# EAGLE schematic DRYER CONTROLLER (EAGLE 7.4.0)

## Sheet 1 of 6
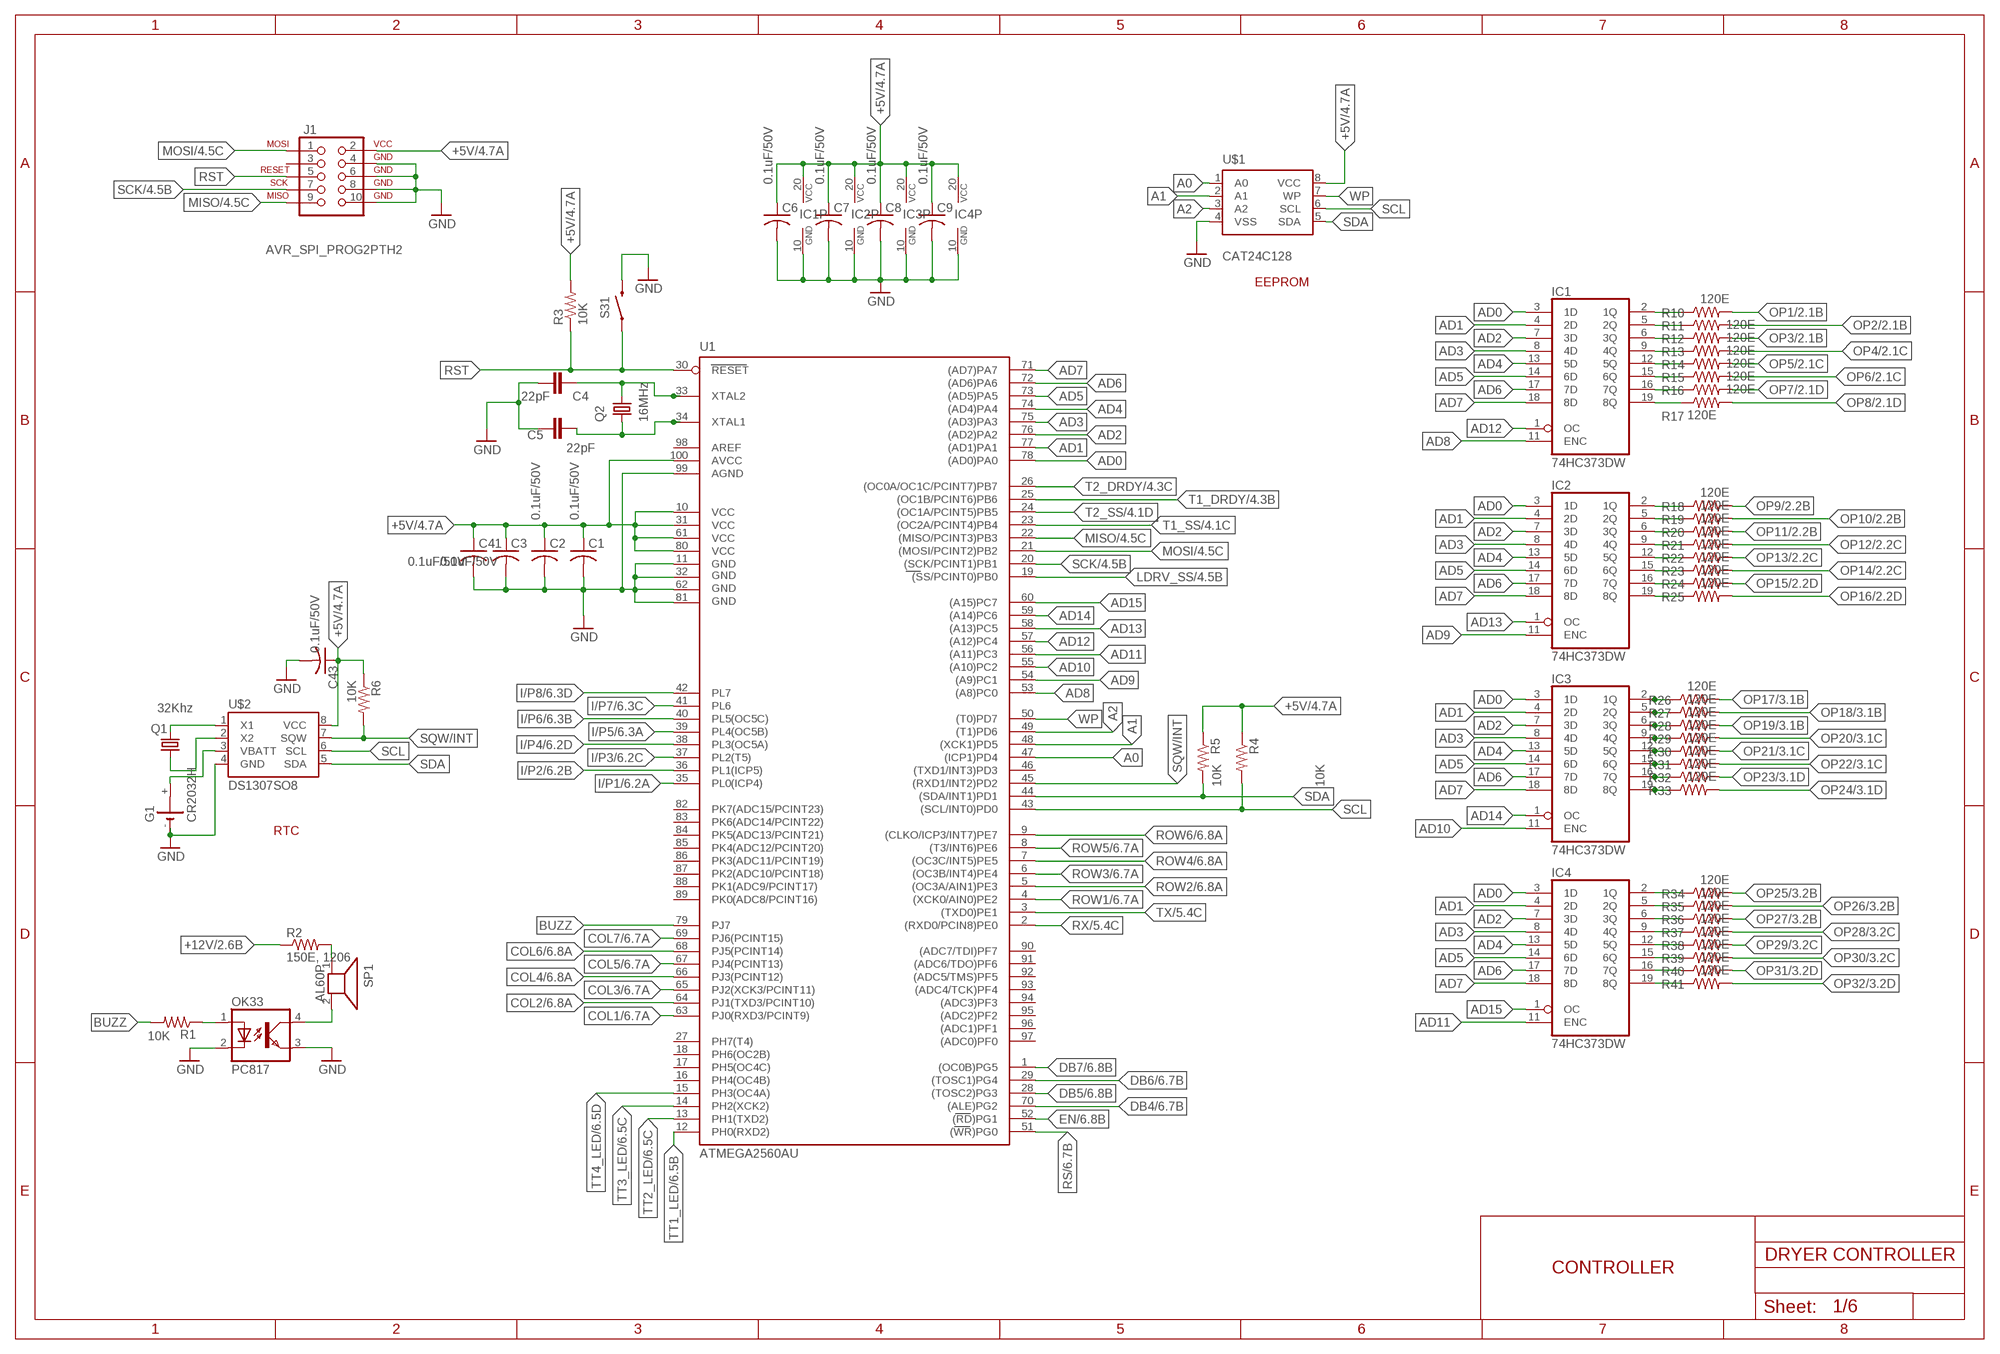
[diagram p0: schematic, sheet 1]

### Parts
C1  0.1uF/50V  C-USC0805K  [C0805K]
C2  0.1uF/50V  C-USC0805K  [C0805K]
C3  0.1uF/50V  C-USC0805K  [C0805K]
C4  22pF  CAP0805  [0805]
C5  22pF  CAP0805  [0805]
C6  0.1uF/50V  C-USC0805K  [C0805K]
C7  0.1uF/50V  C-USC0805K  [C0805K]
C8  0.1uF/50V  C-USC0805K  [C0805K]
C9  0.1uF/50V  C-USC0805K  [C0805K]
C41  0.1uF/50V  C-USC0805K  [C0805K]
C43  0.1uF/50V  C-USC0805K  [C0805K]
G1  CR2032H  [CR2032H]
IC1  74HC373DW  [SO20W]
IC2  74HC373DW  [SO20W]
IC3  74HC373DW  [SO20W]
IC4  74HC373DW  [SO20W]
J1  AVR_SPI_PROG2PTH2  [2X5-SHROUDED]
OK33  PC817  [DIL04]
Q1  32Khz  CRYSTALHC49S  [HC49/S]
Q2  16MHz  CRYSTALHC49S  [HC49/S]
R1  10K  R-US_R0805  [R0805]
R2  150E, 1206  R-US_R1206  [R1206]
R3  10K  R-US_R0805  [R0805]
R4  10K  R-US_R0805  [R0805]
R5  10K  R-US_R0805  [R0805]
R6  10K  R-US_R0805  [R0805]
R10  120E  R-US_R0805  [R0805]
R11  120E  R-US_R0805  [R0805]
R12  120E  R-US_R0805  [R0805]
R13  120E  R-US_R0805  [R0805]
R14  120E  R-US_R0805  [R0805]
R15  120E  R-US_R0805  [R0805]
R16  120E  R-US_R0805  [R0805]
R17  120E  R-US_R0805  [R0805]
R18  120E  R-US_R0805  [R0805]
R19  120E  R-US_R0805  [R0805]
R20  120E  R-US_R0805  [R0805]
R21  120E  R-US_R0805  [R0805]
R22  120E  R-US_R0805  [R0805]
R23  120E  R-US_R0805  [R0805]
R24  120E  R-US_R0805  [R0805]
R25  120E  R-US_R0805  [R0805]
R26  120E  R-US_R0805  [R0805]
R27  120E  R-US_R0805  [R0805]
R28  120E  R-US_R0805  [R0805]
R29  120E  R-US_R0805  [R0805]
R30  120E  R-US_R0805  [R0805]
R31  120E  R-US_R0805  [R0805]
R32  120E  R-US_R0805  [R0805]
R33  120E  R-US_R0805  [R0805]
R34  120E  R-US_R0805  [R0805]
R35  120E  R-US_R0805  [R0805]
R36  120E  R-US_R0805  [R0805]
R37  120E  R-US_R0805  [R0805]
R38  120E  R-US_R0805  [R0805]
R39  120E  R-US_R0805  [R0805]
R40  120E  R-US_R0805  [R0805]
R41  120E  R-US_R0805  [R0805]
S31  SWITCH-MOMENTARY-2SMD-4  [TACTILE_SWITCH_TALL]
SP1  AL60P  [AL60P]
U1  ATMEGA2560AU  [TQFP100]
U$1  CAT24C128  [SOIC8]
U$2  DS1307SO8  [SO08]

### Nets
+5V: C1.1 C2.1 C3.1 C6.1 C7.1 C8.1 C9.1 C41.1 C43.1 IC1.20(VCC) IC2.20(VCC) IC3.20(VCC) IC4.20(VCC) J1.2(VCC) R3.2 R4.1 R5.1 R6.1 U1.10(VCC) U1.31(VCC1) U1.61(VCC2) U1.80(VCC3) U1.100(AVCC) U$1.8(VCC) U$2.8(VCC) ; also sheet 4,5,6
+12V: R2.1 ; also sheet 2,3,4,6
A0: U1.47((ICP1)PD4) U$1.1(A0)
A1: U1.48((XCK1)PD5) U$1.2(A1)
A2: U1.49((T1)PD6) U$1.3(A2)
AD0: IC1.3(1D) IC2.3(1D) IC3.3(1D) IC4.3(1D) U1.78((AD0)PA0)
AD1: IC1.4(2D) IC2.4(2D) IC3.4(2D) IC4.4(2D) U1.77((AD1)PA1)
AD2: IC1.7(3D) IC2.7(3D) IC3.7(3D) IC4.7(3D) U1.76((AD2)PA2)
AD3: IC1.8(4D) IC2.8(4D) IC3.8(4D) IC4.8(4D) U1.75((AD3)PA3)
AD4: IC1.13(5D) IC2.13(5D) IC3.13(5D) IC4.13(5D) U1.74((AD4)PA4)
AD5: IC1.14(6D) IC2.14(6D) IC3.14(6D) IC4.14(6D) U1.73((AD5)PA5)
AD6: IC1.17(7D) IC2.17(7D) IC3.17(7D) IC4.17(7D) U1.72((AD6)PA6)
AD7: IC1.18(8D) IC2.18(8D) IC3.18(8D) IC4.18(8D) U1.71((AD7)PA7)
AD8: IC1.11(ENC) U1.53((A8)PC0)
AD9: IC2.11(ENC) U1.54((A9)PC1)
AD10: IC3.11(ENC) U1.55((A10)PC2)
AD11: IC4.11(ENC) U1.56((A11)PC3)
AD12: IC1.1(OC) U1.57((A12)PC4)
AD13: IC2.1(OC) U1.58((A13)PC5)
AD14: IC3.1(OC) U1.59((A14)PC6)
AD15: IC4.1(OC) U1.60((A15)PC7)
BUZZ: R1.2 U1.79(PJ7)
COL1: U1.63(PJ0(RXD3/PCINT9)) ; also sheet 6
COL2: U1.64(PJ1(TXD3/PCINT10)) ; also sheet 6
COL3: U1.65(PJ2(XCK3/PCINT11)) ; also sheet 6
COL4: U1.66(PJ3(PCINT12)) ; also sheet 6
COL5: U1.67(PJ4(PCINT13)) ; also sheet 6
COL6: U1.68(PJ5(PCINT14)) ; also sheet 6
COL7: U1.69(PJ6(PCINT15)) ; also sheet 6
DB4: U1.70((ALE)PG2) ; also sheet 6
DB5: U1.28((TOSC2)PG3) ; also sheet 6
DB6: U1.29((TOSC1)PG4) ; also sheet 6
DB7: U1.1((OC0B)PG5) ; also sheet 6
EN: U1.52((RD)PG1) ; also sheet 6
GND [gnd]: C1.2 C2.2 C3.2 C4.1 C5.1 C6.2 C7.2 C8.2 C9.2 C41.2 C43.2 G1.- IC1.10(GND) IC2.10(GND) IC3.10(GND) IC4.10(GND) J1.4(GND) J1.6(GND) J1.8(GND) J1.10(GND) OK33.2(C) OK33.3(EMIT) S31.B2 U1.11(GND) U1.32(GND1) U1.62(GND2) U1.81(GND3) U1.99(AGND) U$1.4(VSS) U$2.4(GND) ; also sheet 2,3,4,5,6
I/P1: U1.35(PL0(ICP4)) ; also sheet 6
I/P2: U1.36(PL1(ICP5)) ; also sheet 6
I/P3: U1.37(PL2(T5)) ; also sheet 6
I/P4: U1.38(PL3(OC5A)) ; also sheet 6
I/P5: U1.39(PL4(OC5B)) ; also sheet 6
I/P6: U1.40(PL5(OC5C)) ; also sheet 6
I/P7: U1.41(PL6) ; also sheet 6
I/P8: U1.42(PL7) ; also sheet 6
LDRV_SS: U1.19((SS/PCINT0)PB0) ; also sheet 4
MISO: J1.9(MISO) U1.22((MISO/PCINT3)PB3) ; also sheet 4
MOSI: J1.1(MOSI) U1.21((MOSI/PCINT2)PB2) ; also sheet 4
N$3: G1.+ U$2.3(VBATT)
N$4: Q1.2 U$2.2(X2)
N$5: Q1.1 U$2.1(X1)
N$6: C4.2 Q2.2 U1.33(XTAL2)
N$7: C5.2 Q2.1 U1.34(XTAL1)
N$8: IC1.2(1Q) R10.1
N$9: R2.2 SP1.1
N$10: OK33.1(A) R1.1
N$11: IC1.5(2Q) R11.1
N$12: IC1.6(3Q) R12.1
N$13: IC1.9(4Q) R13.1
N$14: IC1.12(5Q) R14.1
N$15: IC1.15(6Q) R15.1
N$16: IC1.16(7Q) R16.1
N$17: IC1.19(8Q) R17.1
N$18: IC2.2(1Q) R18.1
N$19: IC2.5(2Q) R19.1
N$20: IC2.6(3Q) R20.1
N$21: IC2.9(4Q) R21.1
N$22: IC2.12(5Q) R22.1
N$23: IC2.15(6Q) R23.1
N$24: IC2.16(7Q) R24.1
N$25: IC2.19(8Q) R25.1
N$26: IC3.2(1Q) R26.1
N$27: IC3.5(2Q) R27.1
N$28: IC3.6(3Q) R28.1
N$29: IC3.9(4Q) R29.1
N$30: IC3.12(5Q) R30.1
N$31: IC3.15(6Q) R31.1
N$32: IC3.16(7Q) R32.1
N$33: IC4.19(8Q) R41.1
N$34: IC3.19(8Q) R33.1
N$35: IC4.16(7Q) R40.1
N$36: IC4.15(6Q) R39.1
N$37: IC4.12(5Q) R38.1
N$38: IC4.9(4Q) R37.1
N$39: IC4.6(3Q) R36.1
N$40: IC4.5(2Q) R35.1
N$41: IC4.2(1Q) R34.1
N$74: OK33.4(COL) SP1.2
OP1: R10.2 ; also sheet 2
OP2: R11.2 ; also sheet 2
OP3: R12.2 ; also sheet 2
OP4: R13.2 ; also sheet 2
OP5: R14.2 ; also sheet 2
OP6: R15.2 ; also sheet 2
OP7: R16.2 ; also sheet 2
OP8: R17.2 ; also sheet 2
OP9: R18.2 ; also sheet 2
OP10: R19.2 ; also sheet 2
OP11: R20.2 ; also sheet 2
OP12: R21.2 ; also sheet 2
OP13: R22.2 ; also sheet 2
OP14: R23.2 ; also sheet 2
OP15: R24.2 ; also sheet 2
OP16: R25.2 ; also sheet 2
OP17: R26.2 ; also sheet 3
OP18: R27.2 ; also sheet 3
OP19: R28.2 ; also sheet 3
OP20: R29.2 ; also sheet 3
OP21: R30.2 ; also sheet 3
OP22: R31.2 ; also sheet 3
OP23: R32.2 ; also sheet 3
OP24: R33.2 ; also sheet 3
OP25: R34.2 ; also sheet 3
OP26: R35.2 ; also sheet 3
OP27: R36.2 ; also sheet 3
OP28: R37.2 ; also sheet 3
OP29: R38.2 ; also sheet 3
OP30: R39.2 ; also sheet 3
OP31: R40.2 ; also sheet 3
OP32: R41.2 ; also sheet 3
ROW1: U1.4((XCK0/AIN0)PE2) ; also sheet 6
ROW2: U1.5((OC3A/AIN1)PE3) ; also sheet 6
ROW3: U1.6((OC3B/INT4)PE4) ; also sheet 6
ROW4: U1.7((OC3C/INT5)PE5) ; also sheet 6
ROW5: U1.8((T3/INT6)PE6) ; also sheet 6
ROW6: U1.9((CLKO/ICP3/INT7)PE7) ; also sheet 6
RS: U1.51((WR)PG0) ; also sheet 6
RST: J1.5(RESET) R3.1 S31.A2 U1.30(RESET)
RX: U1.2((RXD0/PCIN8)PE0) ; also sheet 5
SCK: J1.7(SCK) U1.20((SCK/PCINT1)PB1) ; also sheet 4
SCL: R4.2 U1.43((SCL/INT0)PD0) U$1.6(SCL) U$2.6(SCL)
SDA: R5.2 U1.44((SDA/INT1)PD1) U$1.5(SDA) U$2.5(SDA)
SQW/INT: R6.2 U1.45((RXD1/INT2)PD2) U$2.7(SQW)
T1_DRDY: U1.25((OC1B/PCINT6)PB6) ; also sheet 4
T1_SS: U1.23((OC2A/PCINT4)PB4) ; also sheet 4
T2_DRDY: U1.26((OC0A/OC1C/PCINT7)PB7) ; also sheet 4
T2_SS: U1.24((OC1A/PCINT5)PB5) ; also sheet 4
TT1_LED: U1.12(PH0(RXD2)) ; also sheet 6
TT2_LED: U1.13(PH1(TXD2)) ; also sheet 6
TT3_LED: U1.14(PH2(XCK2)) ; also sheet 6
TT4_LED: U1.15(PH3(OC4A)) ; also sheet 6
TX: U1.3((TXD0)PE1) ; also sheet 5
WP: U1.50((T0)PD7) U$1.7(WP)
Unconnected: G1.+@1(+) J1.3(NC) U1.16(PH4(OC4B)) U1.17(PH5(OC4C)) U1.18(PH6(OC2B)) U1.27(PH7(T4)) U1.46((TXD1/INT3)PD3) U1.82(PK7(ADC15/PCINT23)) U1.83(PK6(ADC14/PCINT22)) U1.84(PK5(ADC13/PCINT21)) U1.85(PK4(ADC12/PCINT20)) U1.86(PK3(ADC11/PCINT19)) U1.87(PK2(ADC10/PCINT18)) U1.88(PK1(ADC9/PCINT17)) U1.89(PK0(ADC8/PCINT16)) U1.90((ADC7/TDI)PF7) U1.91((ADC6/TDO)PF6) U1.92((ADC5/TMS)PF5) U1.93((ADC4/TCK)PF4) U1.94((ADC3)PF3) U1.95((ADC2)PF2) U1.96((ADC1)PF1) U1.97((ADC0)PF0) U1.98(AREF)

### Notes on the sheet
- EEPROM
- RTC
- CONTROLLER

## Sheet 2 of 6
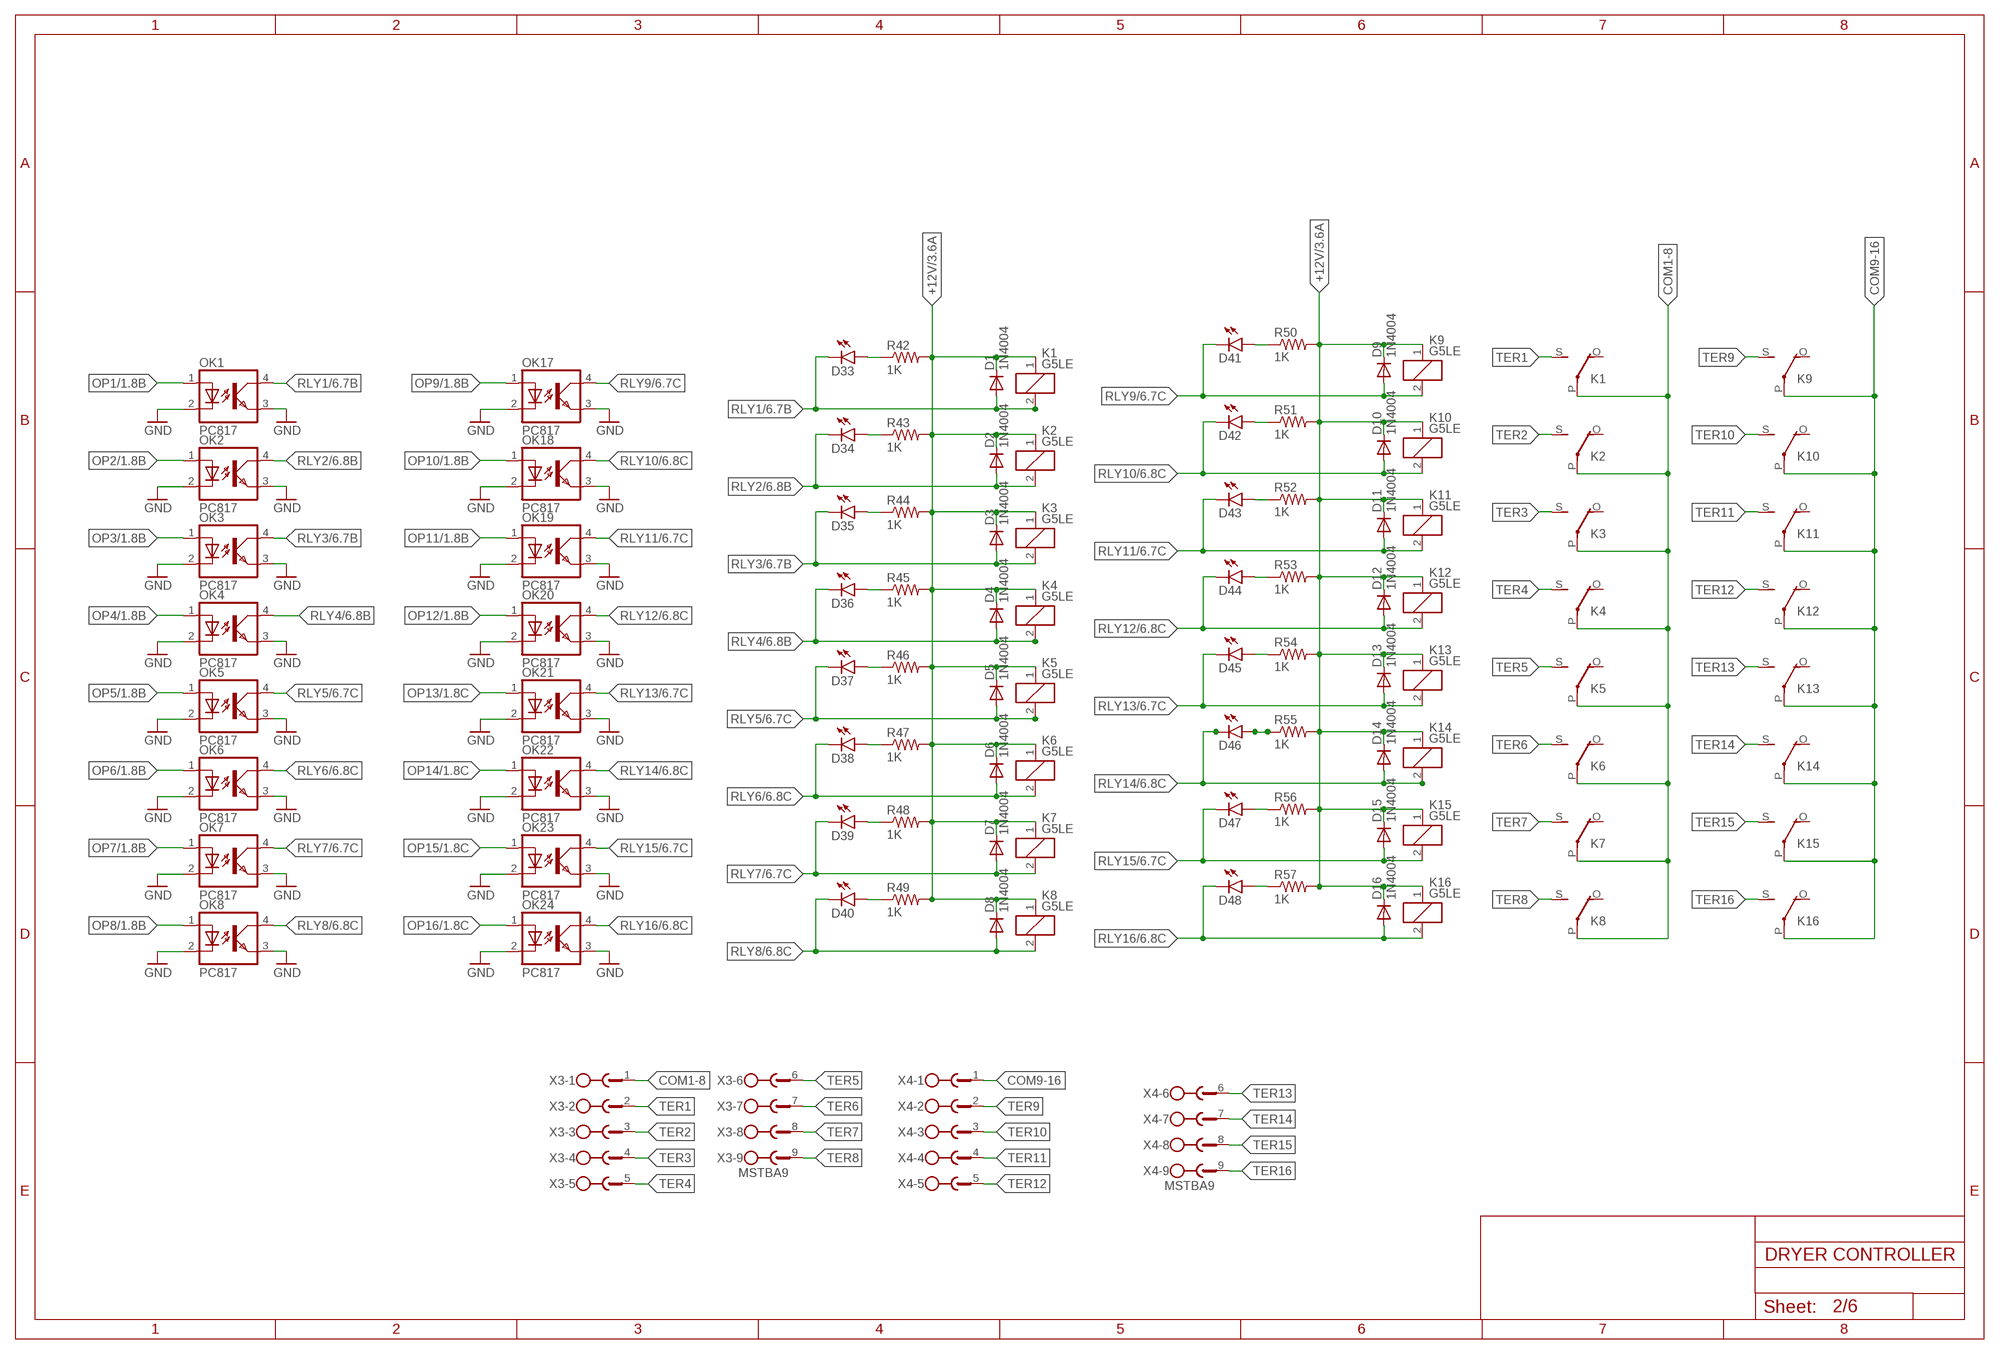
[diagram p1: schematic, sheet 2]

### Parts
D1  1N4004  [DO41-10]
D2  1N4004  [DO41-10]
D3  1N4004  [DO41-10]
D4  1N4004  [DO41-10]
D5  1N4004  [DO41-10]
D6  1N4004  [DO41-10]
D7  1N4004  [DO41-10]
D8  1N4004  [DO41-10]
D9  1N4004  [DO41-10]
D10  1N4004  [DO41-10]
D11  1N4004  [DO41-10]
D12  1N4004  [DO41-10]
D13  1N4004  [DO41-10]
D14  1N4004  [DO41-10]
D15  1N4004  [DO41-10]
D16  1N4004  [DO41-10]
D33  LED1206  [LED-1206]
D34  LED1206  [LED-1206]
D35  LED1206  [LED-1206]
D36  LED1206  [LED-1206]
D37  LED1206  [LED-1206]
D38  LED1206  [LED-1206]
D39  LED1206  [LED-1206]
D40  LED1206  [LED-1206]
D41  LED1206  [LED-1206]
D42  LED1206  [LED-1206]
D43  LED1206  [LED-1206]
D44  LED1206  [LED-1206]
D45  LED1206  [LED-1206]
D46  LED1206  [LED-1206]
D47  LED1206  [LED-1206]
D48  LED1206  [LED-1206]
K1  G5LE  [G5LE]
K2  G5LE  [G5LE]
K3  G5LE  [G5LE]
K4  G5LE  [G5LE]
K5  G5LE  [G5LE]
K6  G5LE  [G5LE]
K7  G5LE  [G5LE]
K8  G5LE  [G5LE]
K9  G5LE  [G5LE]
K10  G5LE  [G5LE]
K11  G5LE  [G5LE]
K12  G5LE  [G5LE]
K13  G5LE  [G5LE]
K14  G5LE  [G5LE]
K15  G5LE  [G5LE]
K16  G5LE  [G5LE]
OK1  PC817  [DIL04]
OK2  PC817  [DIL04]
OK3  PC817  [DIL04]
OK4  PC817  [DIL04]
OK5  PC817  [DIL04]
OK6  PC817  [DIL04]
OK7  PC817  [DIL04]
OK8  PC817  [DIL04]
OK17  PC817  [DIL04]
OK18  PC817  [DIL04]
OK19  PC817  [DIL04]
OK20  PC817  [DIL04]
OK21  PC817  [DIL04]
OK22  PC817  [DIL04]
OK23  PC817  [DIL04]
OK24  PC817  [DIL04]
R42  1K  R-US_R0805  [R0805]
R43  1K  R-US_R0805  [R0805]
R44  1K  R-US_R0805  [R0805]
R45  1K  R-US_R0805  [R0805]
R46  1K  R-US_R0805  [R0805]
R47  1K  R-US_R0805  [R0805]
R48  1K  R-US_R0805  [R0805]
R49  1K  R-US_R0805  [R0805]
R50  1K  R-US_R0805  [R0805]
R51  1K  R-US_R0805  [R0805]
R52  1K  R-US_R0805  [R0805]
R53  1K  R-US_R0805  [R0805]
R54  1K  R-US_R0805  [R0805]
R55  1K  R-US_R0805  [R0805]
R56  1K  R-US_R0805  [R0805]
R57  1K  R-US_R0805  [R0805]
X3  MSTBA9  [MSTBA9]
X4  MSTBA9  [MSTBA9]

### Nets
+12V: D1.C D2.C D3.C D4.C D5.C D6.C D7.C D8.C D9.C D10.C D11.C D12.C D13.C D14.C D15.C D16.C K1.1 K2.1 K3.1 K4.1 K5.1 K6.1 K7.1 K8.1 K9.1 K10.1 K11.1 K12.1 K13.1 K14.1 K15.1 K16.1 R42.2 R43.2 R44.2 R45.2 R46.2 R47.2 R48.2 R49.2 R50.2 R51.2 R52.2 R53.2 R54.2 R55.2 R56.2 R57.2 ; also sheet 1,3,4,6
COM1-8: K1.P(2:P) K2.P(2:P) K3.P(2:P) K4.P(2:P) K5.P(2:P) K6.P(2:P) K7.P(2:P) K8.P(2:P) X3.1
COM9-16: K9.P(2:P) K10.P(2:P) K11.P(2:P) K12.P(2:P) K13.P(2:P) K14.P(2:P) K15.P(2:P) K16.P(2:P) X4.1
GND [gnd]: OK1.2(C) OK1.3(EMIT) OK2.2(C) OK2.3(EMIT) OK3.2(C) OK3.3(EMIT) OK4.2(C) OK4.3(EMIT) OK5.2(C) OK5.3(EMIT) OK6.2(C) OK6.3(EMIT) OK7.2(C) OK7.3(EMIT) OK8.2(C) OK8.3(EMIT) OK17.2(C) OK17.3(EMIT) OK18.2(C) OK18.3(EMIT) OK19.2(C) OK19.3(EMIT) OK20.2(C) OK20.3(EMIT) OK21.2(C) OK21.3(EMIT) OK22.2(C) OK22.3(EMIT) OK23.2(C) OK23.3(EMIT) OK24.2(C) OK24.3(EMIT) ; also sheet 1,3,4,5,6
N$42: D33.A R42.1
N$43: D34.A R43.1
N$44: D35.A R44.1
N$45: D36.A R45.1
N$46: D37.A R46.1
N$47: D38.A R47.1
N$48: D39.A R48.1
N$49: D40.A R49.1
N$50: D41.A R50.1
N$51: D42.A R51.1
N$52: D43.A R52.1
N$53: D44.A R53.1
N$55: D45.A R54.1
N$58: D47.A R56.1
N$59: D48.A R57.1
N$73: D46.A R55.1
OP1: OK1.1(A) ; also sheet 1
OP2: OK2.1(A) ; also sheet 1
OP3: OK3.1(A) ; also sheet 1
OP4: OK4.1(A) ; also sheet 1
OP5: OK5.1(A) ; also sheet 1
OP6: OK6.1(A) ; also sheet 1
OP7: OK7.1(A) ; also sheet 1
OP8: OK8.1(A) ; also sheet 1
OP9: OK17.1(A) ; also sheet 1
OP10: OK18.1(A) ; also sheet 1
OP11: OK19.1(A) ; also sheet 1
OP12: OK20.1(A) ; also sheet 1
OP13: OK21.1(A) ; also sheet 1
OP14: OK22.1(A) ; also sheet 1
OP15: OK23.1(A) ; also sheet 1
OP16: OK24.1(A) ; also sheet 1
RLY1: D1.A D33.C K1.2 OK1.4(COL) ; also sheet 6
RLY2: D2.A D34.C K2.2 OK2.4(COL) ; also sheet 6
RLY3: D3.A D35.C K3.2 OK3.4(COL) ; also sheet 6
RLY4: D4.A D36.C K4.2 OK4.4(COL) ; also sheet 6
RLY5: D5.A D37.C K5.2 OK5.4(COL) ; also sheet 6
RLY6: D6.A D38.C K6.2 OK6.4(COL) ; also sheet 6
RLY7: D7.A D39.C K7.2 OK7.4(COL) ; also sheet 6
RLY8: D8.A D40.C K8.2 OK8.4(COL) ; also sheet 6
RLY9: D9.A D41.C K9.2 OK17.4(COL) ; also sheet 6
RLY10: D10.A D42.C K10.2 OK18.4(COL) ; also sheet 6
RLY11: D11.A D43.C K11.2 OK19.4(COL) ; also sheet 6
RLY12: D12.A D44.C K12.2 OK20.4(COL) ; also sheet 6
RLY13: D13.A D45.C K13.2 OK21.4(COL) ; also sheet 6
RLY14: D14.A D46.C K14.2 OK22.4(COL) ; also sheet 6
RLY15: D15.A D47.C K15.2 OK23.4(COL) ; also sheet 6
RLY16: D16.A D48.C K16.2 OK24.4(COL) ; also sheet 6
TER1: K1.S(2:S) X3.2
TER2: K2.S(2:S) X3.3
TER3: K3.S(2:S) X3.4
TER4: K4.S(2:S) X3.5
TER5: K5.S(2:S) X3.6
TER6: K6.S(2:S) X3.7
TER7: K7.S(2:S) X3.8
TER8: K8.S(2:S) X3.9
TER9: K9.S(2:S) X4.2
TER10: K10.S(2:S) X4.3
TER11: K11.S(2:S) X4.4
TER12: K12.S(2:S) X4.5
TER13: K13.S(2:S) X4.6
TER14: K14.S(2:S) X4.7
TER15: K15.S(2:S) X4.8
TER16: K16.S(2:S) X4.9
Unconnected: K1.O(2:O) K2.O(2:O) K3.O(2:O) K4.O(2:O) K5.O(2:O) K6.O(2:O) K7.O(2:O) K8.O(2:O) K9.O(2:O) K10.O(2:O) K11.O(2:O) K12.O(2:O) K13.O(2:O) K14.O(2:O) K15.O(2:O) K16.O(2:O)

## Sheet 3 of 6
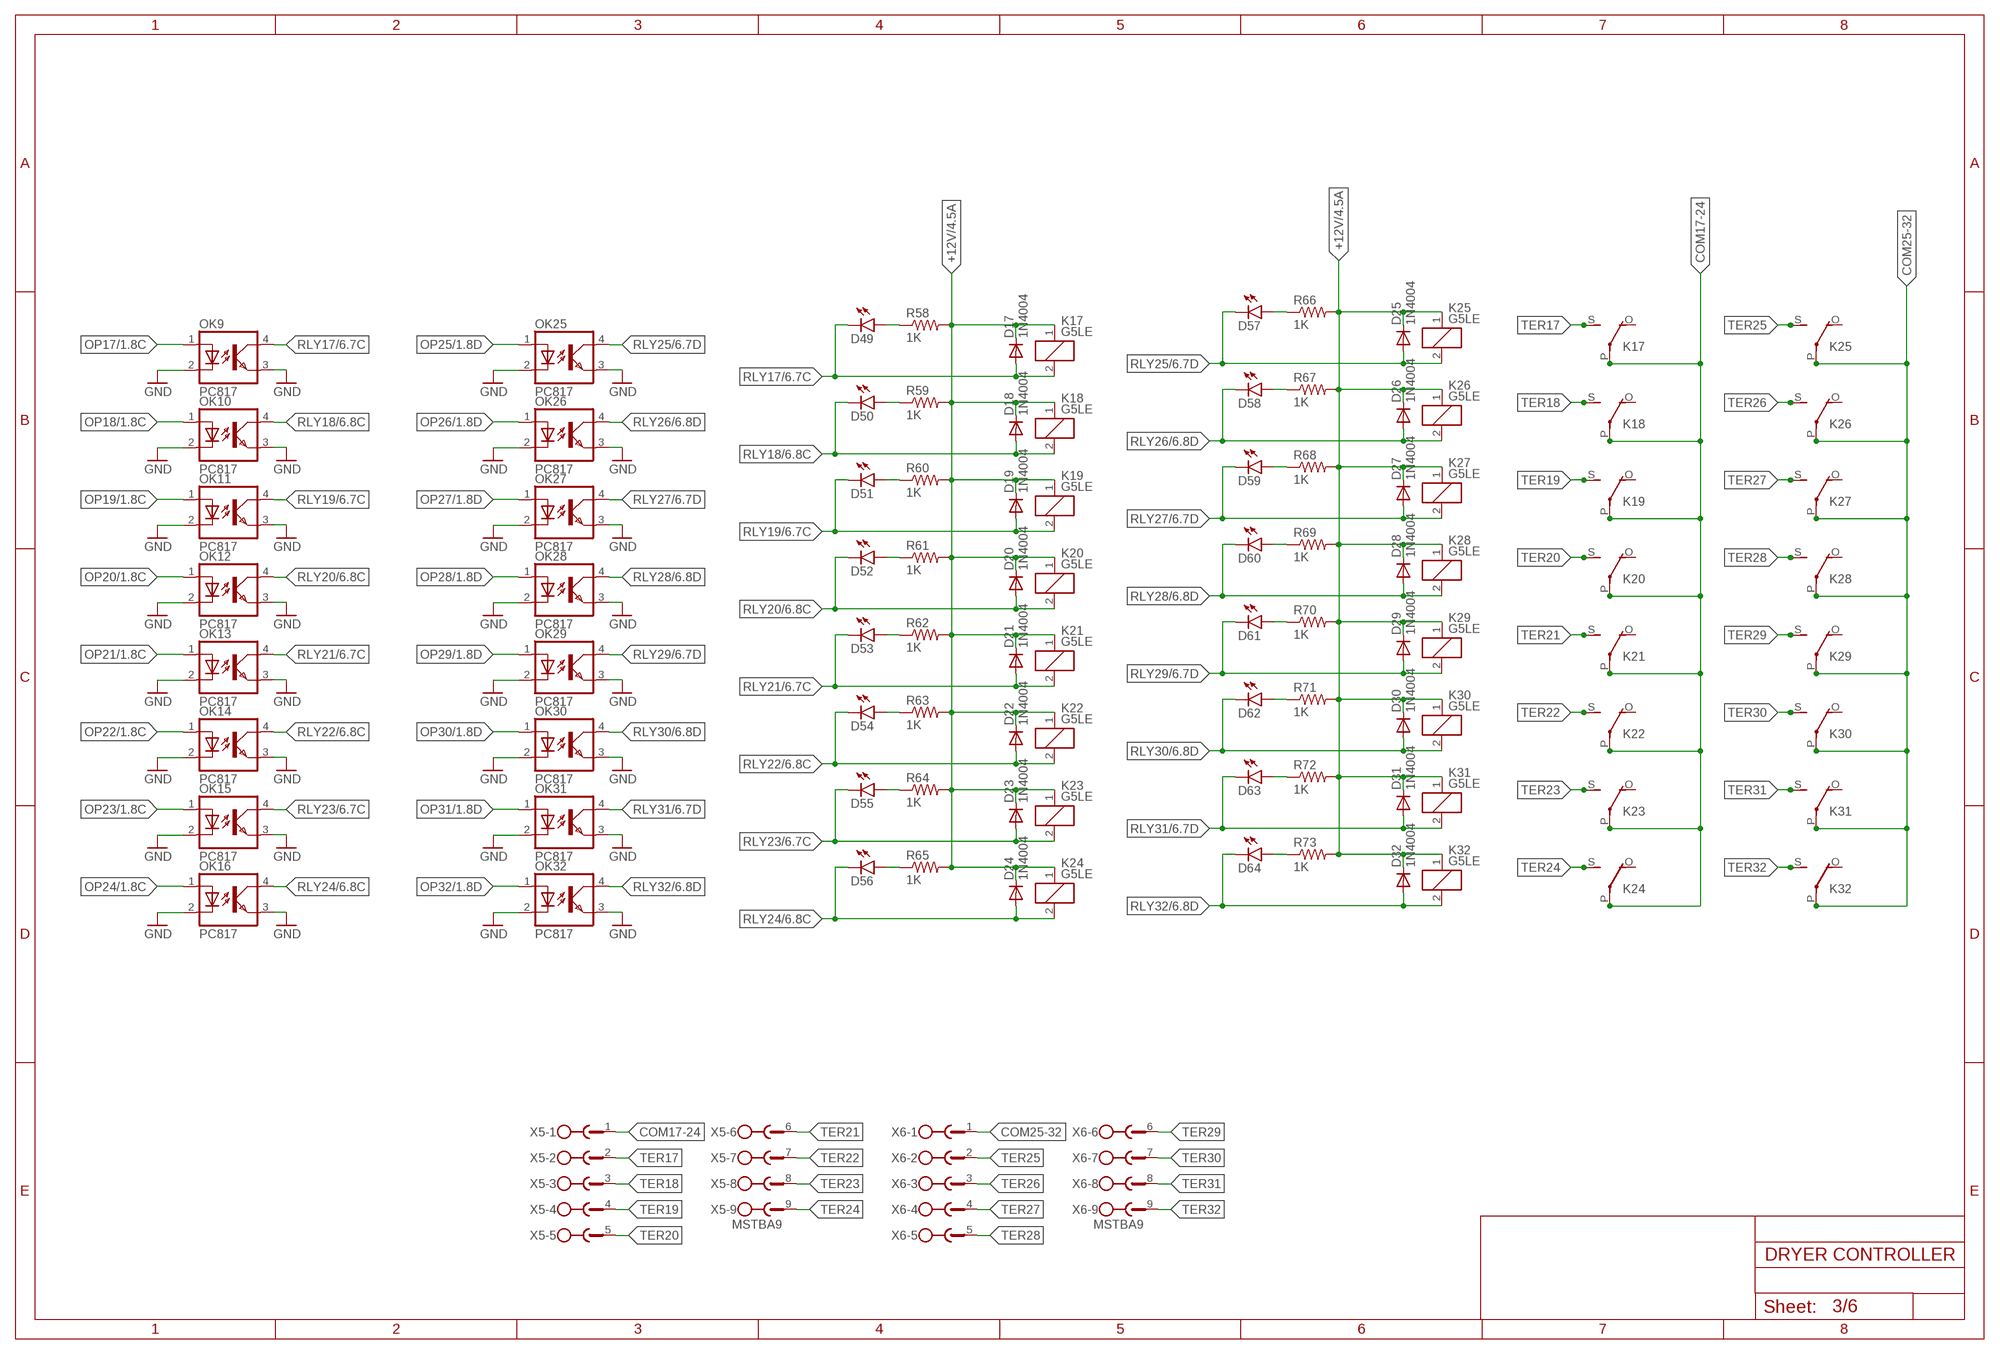
[diagram p2: schematic, sheet 3]

### Parts
D17  1N4004  [DO41-10]
D18  1N4004  [DO41-10]
D19  1N4004  [DO41-10]
D20  1N4004  [DO41-10]
D21  1N4004  [DO41-10]
D22  1N4004  [DO41-10]
D23  1N4004  [DO41-10]
D24  1N4004  [DO41-10]
D25  1N4004  [DO41-10]
D26  1N4004  [DO41-10]
D27  1N4004  [DO41-10]
D28  1N4004  [DO41-10]
D29  1N4004  [DO41-10]
D30  1N4004  [DO41-10]
D31  1N4004  [DO41-10]
D32  1N4004  [DO41-10]
D49  LED1206  [LED-1206]
D50  LED1206  [LED-1206]
D51  LED1206  [LED-1206]
D52  LED1206  [LED-1206]
D53  LED1206  [LED-1206]
D54  LED1206  [LED-1206]
D55  LED1206  [LED-1206]
D56  LED1206  [LED-1206]
D57  LED1206  [LED-1206]
D58  LED1206  [LED-1206]
D59  LED1206  [LED-1206]
D60  LED1206  [LED-1206]
D61  LED1206  [LED-1206]
D62  LED1206  [LED-1206]
D63  LED1206  [LED-1206]
D64  LED1206  [LED-1206]
K17  G5LE  [G5LE]
K18  G5LE  [G5LE]
K19  G5LE  [G5LE]
K20  G5LE  [G5LE]
K21  G5LE  [G5LE]
K22  G5LE  [G5LE]
K23  G5LE  [G5LE]
K24  G5LE  [G5LE]
K25  G5LE  [G5LE]
K26  G5LE  [G5LE]
K27  G5LE  [G5LE]
K28  G5LE  [G5LE]
K29  G5LE  [G5LE]
K30  G5LE  [G5LE]
K31  G5LE  [G5LE]
K32  G5LE  [G5LE]
OK9  PC817  [DIL04]
OK10  PC817  [DIL04]
OK11  PC817  [DIL04]
OK12  PC817  [DIL04]
OK13  PC817  [DIL04]
OK14  PC817  [DIL04]
OK15  PC817  [DIL04]
OK16  PC817  [DIL04]
OK25  PC817  [DIL04]
OK26  PC817  [DIL04]
OK27  PC817  [DIL04]
OK28  PC817  [DIL04]
OK29  PC817  [DIL04]
OK30  PC817  [DIL04]
OK31  PC817  [DIL04]
OK32  PC817  [DIL04]
R58  1K  R-US_R0805  [R0805]
R59  1K  R-US_R0805  [R0805]
R60  1K  R-US_R0805  [R0805]
R61  1K  R-US_R0805  [R0805]
R62  1K  R-US_R0805  [R0805]
R63  1K  R-US_R0805  [R0805]
R64  1K  R-US_R0805  [R0805]
R65  1K  R-US_R0805  [R0805]
R66  1K  R-US_R0805  [R0805]
R67  1K  R-US_R0805  [R0805]
R68  1K  R-US_R0805  [R0805]
R69  1K  R-US_R0805  [R0805]
R70  1K  R-US_R0805  [R0805]
R71  1K  R-US_R0805  [R0805]
R72  1K  R-US_R0805  [R0805]
R73  1K  R-US_R0805  [R0805]
X5  MSTBA9  [MSTBA9]
X6  MSTBA9  [MSTBA9]

### Nets
+12V: D17.C D18.C D19.C D20.C D21.C D22.C D23.C D24.C D25.C D26.C D27.C D28.C D29.C D30.C D31.C D32.C K17.1 K18.1 K19.1 K20.1 K21.1 K22.1 K23.1 K24.1 K25.1 K26.1 K27.1 K28.1 K29.1 K30.1 K31.1 K32.1 R58.2 R59.2 R60.2 R61.2 R62.2 R63.2 R64.2 R65.2 R66.2 R67.2 R68.2 R69.2 R70.2 R71.2 R72.2 R73.2 ; also sheet 1,2,4,6
COM17-24: K17.P(2:P) K18.P(2:P) K19.P(2:P) K20.P(2:P) K21.P(2:P) K22.P(2:P) K23.P(2:P) K24.P(2:P) X5.1
COM25-32: K25.P(2:P) K26.P(2:P) K27.P(2:P) K28.P(2:P) K29.P(2:P) K30.P(2:P) K31.P(2:P) K32.P(2:P) X6.1
GND [gnd]: OK9.2(C) OK9.3(EMIT) OK10.2(C) OK10.3(EMIT) OK11.2(C) OK11.3(EMIT) OK12.2(C) OK12.3(EMIT) OK13.2(C) OK13.3(EMIT) OK14.2(C) OK14.3(EMIT) OK15.2(C) OK15.3(EMIT) OK16.2(C) OK16.3(EMIT) OK25.2(C) OK25.3(EMIT) OK26.2(C) OK26.3(EMIT) OK27.2(C) OK27.3(EMIT) OK28.2(C) OK28.3(EMIT) OK29.2(C) OK29.3(EMIT) OK30.2(C) OK30.3(EMIT) OK31.2(C) OK31.3(EMIT) OK32.2(C) OK32.3(EMIT) ; also sheet 1,2,4,5,6
N$54: D49.A R58.1
N$56: D50.A R59.1
N$57: D51.A R60.1
N$60: D52.A R61.1
N$61: D53.A R62.1
N$62: D54.A R63.1
N$63: D55.A R64.1
N$64: D56.A R65.1
N$65: D57.A R66.1
N$66: D58.A R67.1
N$67: D59.A R68.1
N$68: D60.A R69.1
N$69: D61.A R70.1
N$70: D62.A R71.1
N$71: D63.A R72.1
N$72: D64.A R73.1
OP17: OK9.1(A) ; also sheet 1
OP18: OK10.1(A) ; also sheet 1
OP19: OK11.1(A) ; also sheet 1
OP20: OK12.1(A) ; also sheet 1
OP21: OK13.1(A) ; also sheet 1
OP22: OK14.1(A) ; also sheet 1
OP23: OK15.1(A) ; also sheet 1
OP24: OK16.1(A) ; also sheet 1
OP25: OK25.1(A) ; also sheet 1
OP26: OK26.1(A) ; also sheet 1
OP27: OK27.1(A) ; also sheet 1
OP28: OK28.1(A) ; also sheet 1
OP29: OK29.1(A) ; also sheet 1
OP30: OK30.1(A) ; also sheet 1
OP31: OK31.1(A) ; also sheet 1
OP32: OK32.1(A) ; also sheet 1
RLY17: D17.A D49.C K17.2 OK9.4(COL) ; also sheet 6
RLY18: D18.A D50.C K18.2 OK10.4(COL) ; also sheet 6
RLY19: D19.A D51.C K19.2 OK11.4(COL) ; also sheet 6
RLY20: D20.A D52.C K20.2 OK12.4(COL) ; also sheet 6
RLY21: D21.A D53.C K21.2 OK13.4(COL) ; also sheet 6
RLY22: D22.A D54.C K22.2 OK14.4(COL) ; also sheet 6
RLY23: D23.A D55.C K23.2 OK15.4(COL) ; also sheet 6
RLY24: D24.A D56.C K24.2 OK16.4(COL) ; also sheet 6
RLY25: D25.A D57.C K25.2 OK25.4(COL) ; also sheet 6
RLY26: D26.A D58.C K26.2 OK26.4(COL) ; also sheet 6
RLY27: D27.A D59.C K27.2 OK27.4(COL) ; also sheet 6
RLY28: D28.A D60.C K28.2 OK28.4(COL) ; also sheet 6
RLY29: D29.A D61.C K29.2 OK29.4(COL) ; also sheet 6
RLY30: D30.A D62.C K30.2 OK30.4(COL) ; also sheet 6
RLY31: D31.A D63.C K31.2 OK31.4(COL) ; also sheet 6
RLY32: D32.A D64.C K32.2 OK32.4(COL) ; also sheet 6
TER17: K17.S(2:S) X5.2
TER18: K18.S(2:S) X5.3
TER19: K19.S(2:S) X5.4
TER20: K20.S(2:S) X5.5
TER21: K21.S(2:S) X5.6
TER22: K22.S(2:S) X5.7
TER23: K23.S(2:S) X5.8
TER24: K24.S(2:S) X5.9
TER25: K25.S(2:S) X6.2
TER26: K26.S(2:S) X6.3
TER27: K27.S(2:S) X6.4
TER28: K28.S(2:S) X6.5
TER29: K29.S(2:S) X6.6
TER30: K30.S(2:S) X6.7
TER31: K31.S(2:S) X6.8
TER32: K32.S(2:S) X6.9
Unconnected: K17.O(2:O) K18.O(2:O) K19.O(2:O) K20.O(2:O) K21.O(2:O) K22.O(2:O) K23.O(2:O) K24.O(2:O) K25.O(2:O) K26.O(2:O) K27.O(2:O) K28.O(2:O) K29.O(2:O) K30.O(2:O) K31.O(2:O) K32.O(2:O)

## Sheet 4 of 6
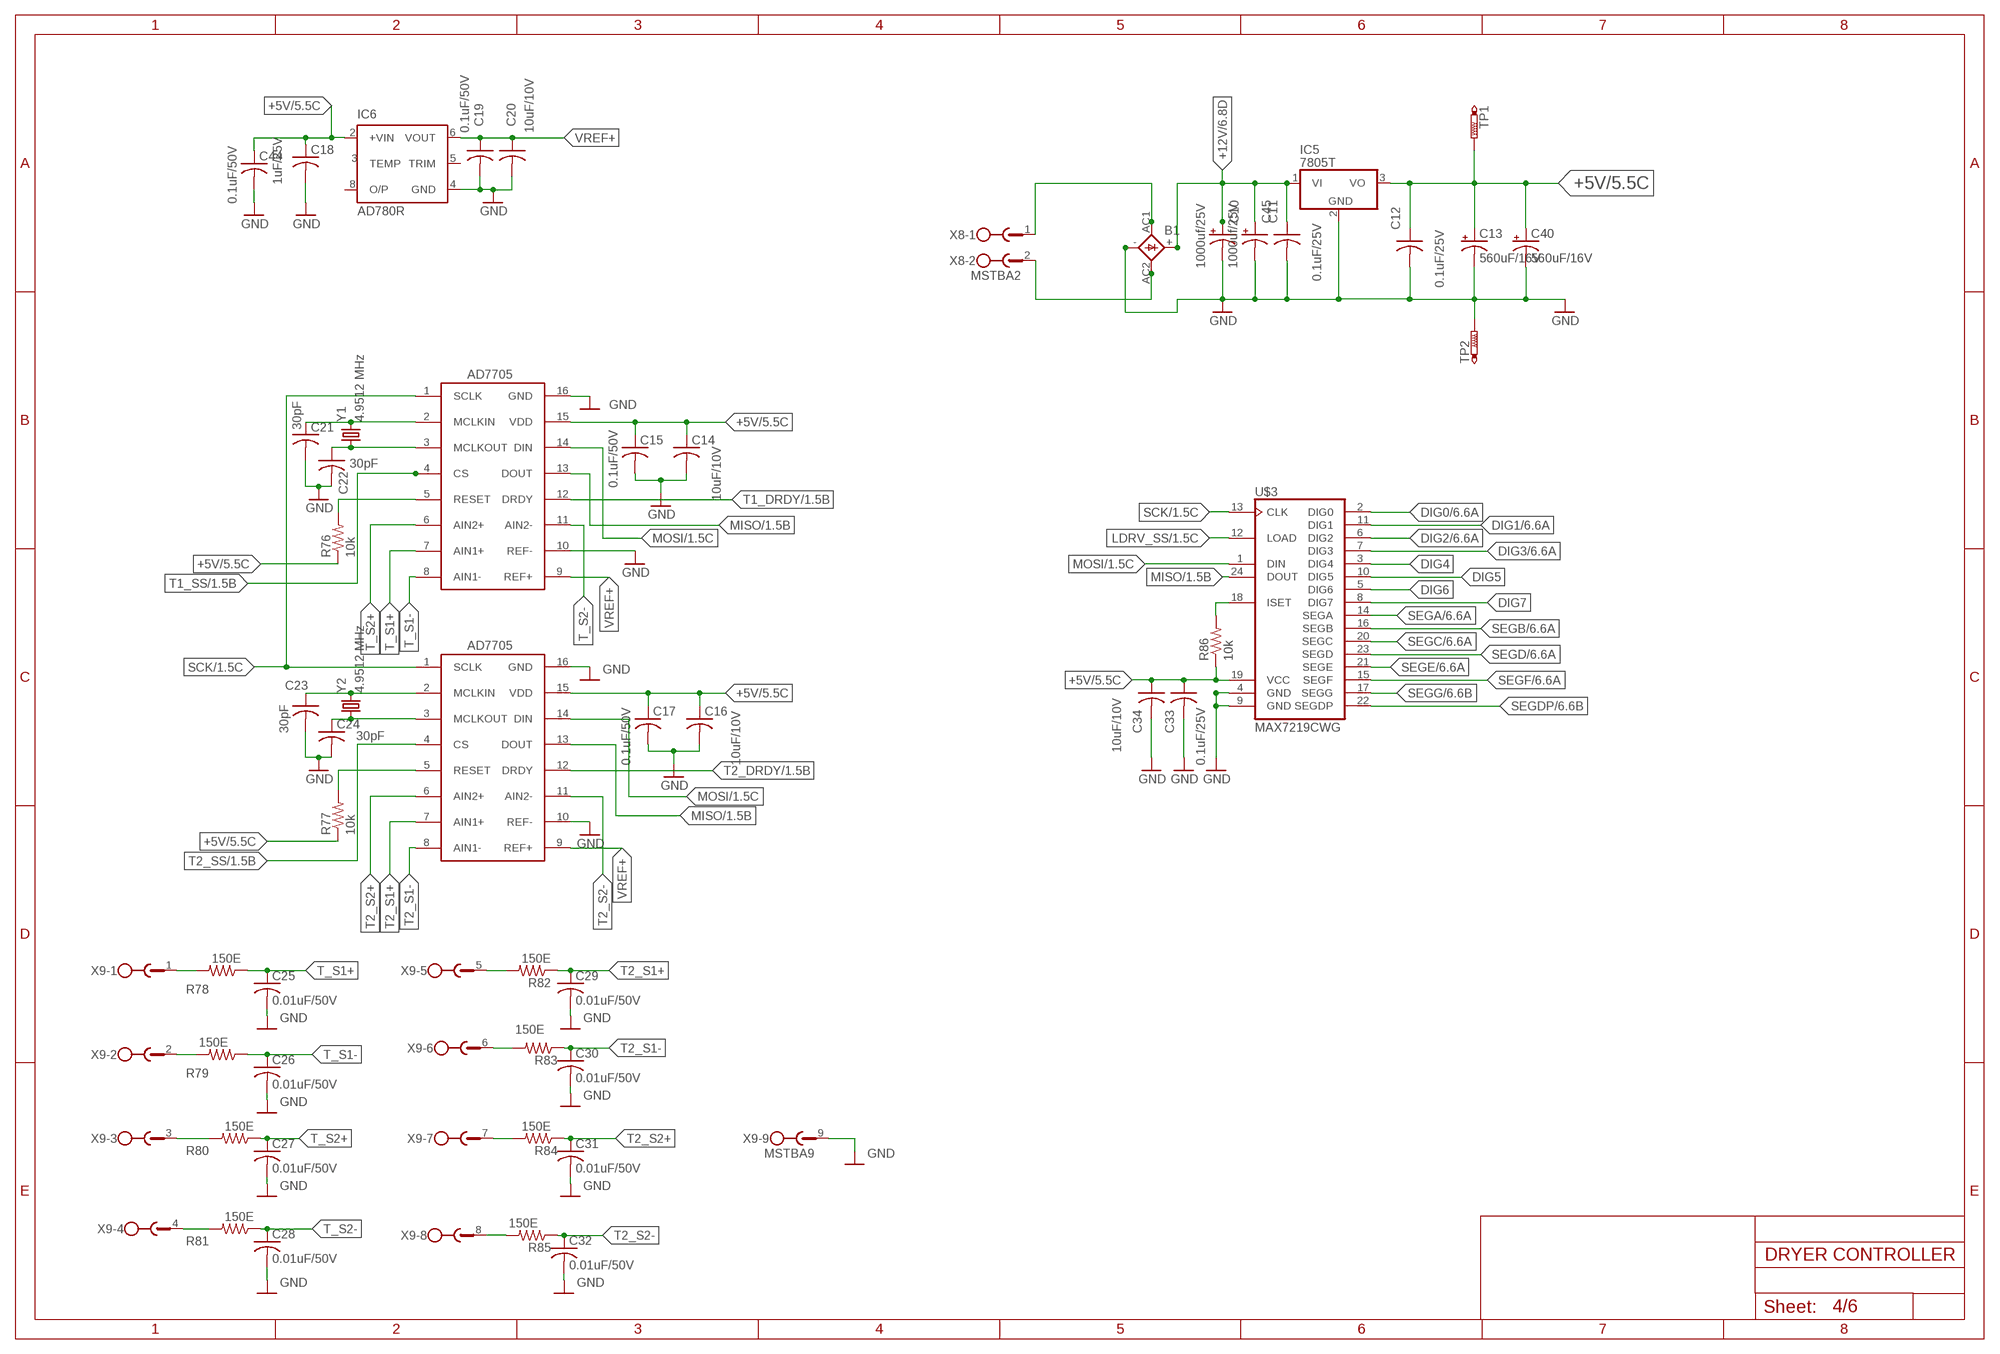
[diagram p3: schematic, sheet 4]

### Parts
B1  2KBP  [2KBP]
C10  1000uf/25V  1000UF-25V(PTH)KIT  [CPOL-RADIAL-1000UF-25V-KIT]
C11  0.1uF/25V  C-USC0805K  [C0805K]
C12  0.1uF/25V  C-USC0805K  [C0805K]
C13  560uF/16V  CPOL-USE5-8.5  [E5-8,5]
C14  10uF/10V  C-USC0805K  [C0805K]
C15  0.1uF/50V  C-USC0805K  [C0805K]
C16  10uF/10V  C-USC0805K  [C0805K]
C17  0.1uF/50V  C-USC0805K  [C0805K]
C18  1uF/25V  C-USC0805K  [C0805K]
C19  0.1uF/50V  C-USC0805K  [C0805K]
C20  10uF/10V  C-USC0805K  [C0805K]
C21  30pF  C-USC0603K  [C0603K]
C22  30pF  C-USC0603K  [C0603K]
C23  30pF  C-USC0603K  [C0603K]
C24  30pF  C-USC0603K  [C0603K]
C25  0.01uF/50V  C-USC0603  [C0603]
C26  0.01uF/50V  C-USC0603  [C0603]
C27  0.01uF/50V  C-USC0603  [C0603]
C28  0.01uF/50V  C-USC0603  [C0603]
C29  0.01uF/50V  C-USC0603  [C0603]
C30  0.01uF/50V  C-USC0603  [C0603]
C31  0.01uF/50V  C-USC0603  [C0603]
C32  0.01uF/50V  C-USC0603  [C0603]
C33  0.1uF/25V  C-USC0805K  [C0805K]
C34  10uF/10V  C-USC0805K  [C0805K]
C40  560uF/16V  CPOL-USE5-8.5  [E5-8,5]
C44  0.1uF/50V  C-USC0805K  [C0805K]
C45  1000uf/25V  1000UF-25V(PTH)KIT  [CPOL-RADIAL-1000UF-25V-KIT]
IC5  7805T  [TO220H]
IC6  AD780R  [SO8]
R76  10k  R-US_R0805  [R0805]
R77  10k  R-US_R0805  [R0805]
R78  150E  R-US_R0805  [R0805]
R79  150E  R-US_R0805  [R0805]
R80  150E  R-US_R0805  [R0805]
R81  150E  R-US_R0805  [R0805]
R82  150E  R-US_R0805  [R0805]
R83  150E  R-US_R0805  [R0805]
R84  150E  R-US_R0805  [R0805]
R85  150E  R-US_R0805  [R0805]
R86  10k  R-US_R0805  [R0805]
TP1  PTR1B2,54  [B2,54]
TP2  PTR1B2,54  [B2,54]
U$3  MAX7219CWG  [SO24L]
U$4  AD7705  [SO-16W]
U$5  AD7705  [SO-16W]
X8  MSTBA2  [MSTBA2]
X9  MSTBA9  [MSTBA9]
Y1  4.9512 MHz  CRYSTALHC49UV  [HC49U-V]
Y2  4.9512 MHz  CRYSTALHC49UV  [HC49U-V]

### Nets
+5V: C12.1 C13.+ C14.1 C15.1 C16.1 C17.1 C18.1 C33.1 C34.1 C40.+ C44.1 IC5.3(VO) IC6.2(+VIN) R76.1 R77.1 R86.1 TP1.TP U$3.19(VCC) U$4.15(VDD) U$5.15(VDD) ; also sheet 1,5,6
+12V: B1.+ C10.+ C11.1 C45.+ IC5.1(VI) ; also sheet 1,2,3,6
DIG0: U$3.2(DIG0) ; also sheet 6
DIG1: U$3.11(DIG1) ; also sheet 6
DIG2: U$3.6(DIG2) ; also sheet 6
DIG3: U$3.7(DIG3) ; also sheet 6
DIG4: U$3.3(DIG4)
DIG5: U$3.10(DIG5)
DIG6: U$3.5(DIG6)
DIG7: U$3.8(DIG7)
GND [gnd]: B1.- C10.- C11.2 C12.2 C13.- C14.2 C15.2 C16.2 C17.2 C18.2 C19.2 C20.2 C21.2 C22.2 C23.2 C24.2 C25.2 C26.2 C27.2 C28.2 C29.2 C30.2 C31.2 C32.2 C33.2 C34.2 C40.- C44.2 C45.- IC5.2(GND) IC6.4(GND) TP2.TP U$3.4(GND) U$3.9(GND) U$4.10(REF-) U$4.16(GND) U$5.10(REF-) U$5.16(GND) X9.9 ; also sheet 1,2,3,5,6
LDRV_SS: U$3.12(LOAD) ; also sheet 1
MISO: U$3.24(DOUT) U$4.13(DOUT) U$5.13(DOUT) ; also sheet 1
MOSI: U$3.1(DIN) U$4.14(DIN) U$5.14(DIN) ; also sheet 1
N$76: B1.AC1 X8.1
N$77: B1.AC2 X8.2
N$78: R78.2 X9.1
N$79: C21.1 U$4.2(MCLKIN) Y1.2
N$80: C22.1 U$4.3(MCLKOUT) Y1.1
N$81: C23.1 U$5.2(MCLKIN) Y2.2
N$82: C24.1 U$5.3(MCLKOUT) Y2.1
N$83: R76.2 U$4.5(RESET)
N$84: R77.2 U$5.5(RESET)
N$85: R79.2 X9.2
N$86: R80.2 X9.3
N$87: R81.2 X9.4
N$88: R82.2 X9.5
N$89: R83.2 X9.6
N$90: R84.2 X9.7
N$91: R85.2 X9.8
N$93: R86.2 U$3.18(ISET)
SCK: U$3.13(CLK) U$4.1(SCLK) U$5.1(SCLK) ; also sheet 1
SEGA: U$3.14(SEGA) ; also sheet 6
SEGB: U$3.16(SEGB) ; also sheet 6
SEGC: U$3.20(SEGC) ; also sheet 6
SEGD: U$3.23(SEGD) ; also sheet 6
SEGDP: U$3.22(SEGDP) ; also sheet 6
SEGE: U$3.21(SEGE) ; also sheet 6
SEGF: U$3.15(SEGF) ; also sheet 6
SEGG: U$3.17(SEGG) ; also sheet 6
T1_DRDY: U$4.12(DRDY) ; also sheet 1
T1_SS: U$4.4(CS) ; also sheet 1
T2_DRDY: U$5.12(DRDY) ; also sheet 1
T2_S1+: C29.1 R82.1 U$5.7(AIN1+)
T2_S1-: C30.1 R83.1 U$5.8(AIN1-)
T2_S2+: C31.1 R84.1 U$5.6(AIN2+)
T2_S2-: C32.1 R85.1 U$5.11(AIN2-)
T2_SS: U$5.4(CS) ; also sheet 1
T_S1+: C25.1 R78.1 U$4.7(AIN1+)
T_S1-: C26.1 R79.1 U$4.8(AIN1-)
T_S2+: C27.1 R80.1 U$4.6(AIN2+)
T_S2-: C28.1 R81.1 U$4.11(AIN2-)
VREF+: C19.1 C20.1 IC6.6(VOUT) U$4.9(REF+) U$5.9(REF+)
Unconnected: IC6.3(TEMP) IC6.5(TRIM) IC6.8(O/P)

## Sheet 5 of 6
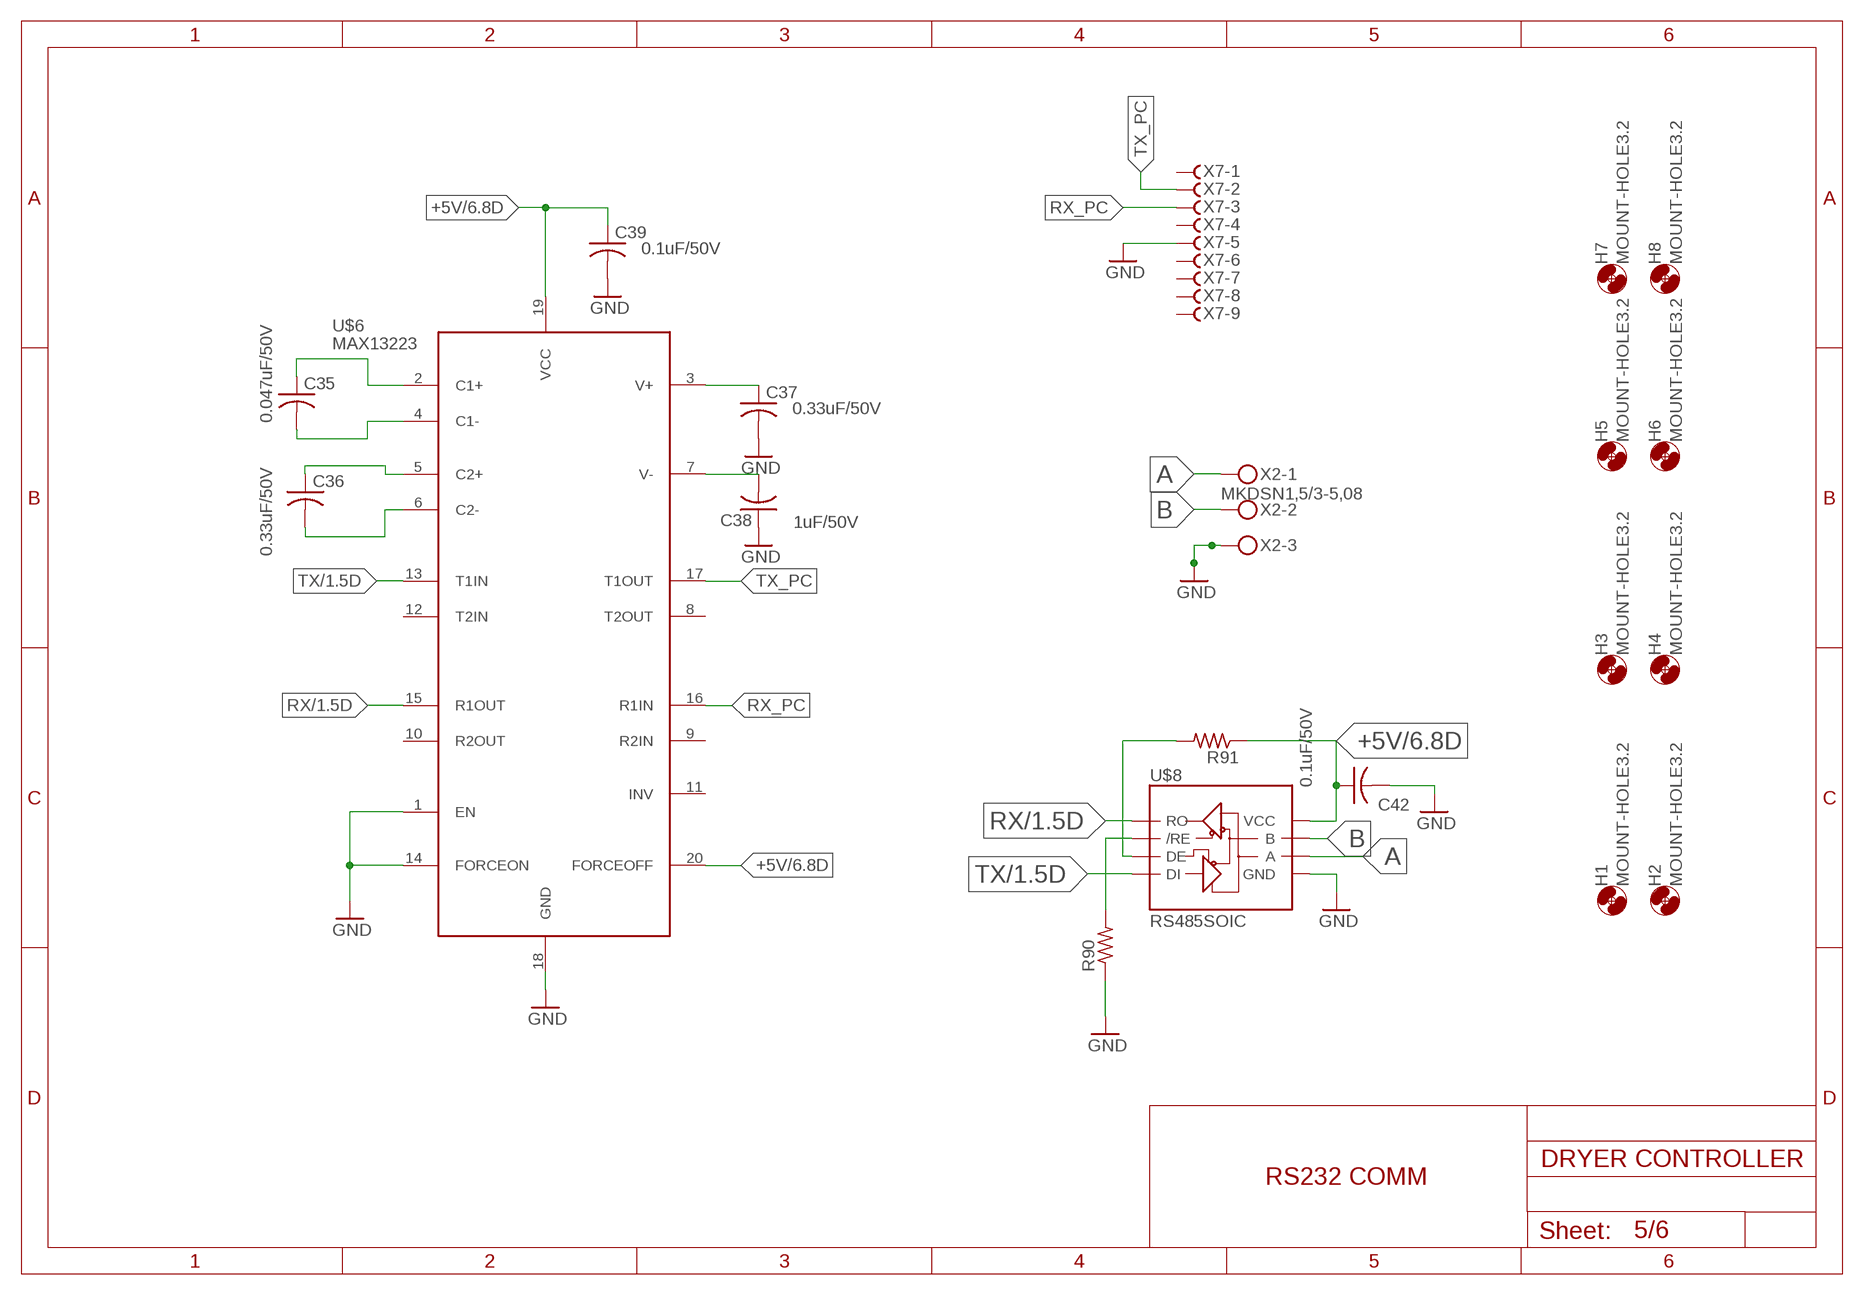
[diagram p4: schematic, sheet 5]

### Parts
C35  0.047uF/50V  C-USC0805K  [C0805K]
C36  0.33uF/50V  C-USC0805K  [C0805K]
C37  0.33uF/50V  C-USC0805K  [C0805K]
C38  1uF/50V  C-USC0805K  [C0805K]
C39  0.1uF/50V  C-USC0805K  [C0805K]
C42  0.1uF/50V  C-USC0805K  [C0805K]
H1  MOUNT-HOLE3.2  [3,2]
H2  MOUNT-HOLE3.2  [3,2]
H3  MOUNT-HOLE3.2  [3,2]
H4  MOUNT-HOLE3.2  [3,2]
H5  MOUNT-HOLE3.2  [3,2]
H6  MOUNT-HOLE3.2  [3,2]
H7  MOUNT-HOLE3.2  [3,2]
H8  MOUNT-HOLE3.2  [3,2]
R90  R-US_R0805  [R0805]
R91  R-US_R0805  [R0805]
U$6  MAX13223  [TSSOP20]
U$8  RS485SOIC  [SO08]
X2  MKDSN1,5/3-5,08  [MKDSN1,5/3-5,08]
X7  F09.590S  [177-009-FEMALE]

### Nets
+5V: C39.1 C42.1 R91.1 U$6.19(VCC) U$6.20(FORCEOFF) U$8.8(VCC) ; also sheet 1,4,6
A: U$8.6(A) X2.1
B: U$8.7(B) X2.2
GND [gnd]: C37.2 C38.1 C39.2 C42.2 R90.1 U$6.1(EN) U$6.14(FORCEON) U$6.18(GND) U$8.5(GND) X2.3 X7.5 ; also sheet 1,2,3,4,6
N$75: C35.1 U$6.2(C1+)
N$92: C35.2 U$6.4(C1-)
N$94: C36.1 U$6.5(C2+)
N$95: C36.2 U$6.6(C2-)
N$96: C37.1 U$6.3(V+)
N$97: C38.2 U$6.7(V-)
N$108: R91.2 U$8.3(DE)
N$110: R90.2 U$8.2(/RE)
RX: U$6.15(R1OUT) U$8.1(RO) ; also sheet 1
RX_PC: U$6.16(R1IN) X7.3
TX: U$6.13(T1IN) U$8.4(DI) ; also sheet 1
TX_PC: U$6.17(T1OUT) X7.2
Unconnected: U$6.8(T2OUT) U$6.9(R2IN) U$6.10(R2OUT) U$6.11(INV) U$6.12(T2IN) X7.1 X7.4 X7.6 X7.7 X7.8 X7.9

### Notes on the sheet
- RS232 COMM

## Sheet 6 of 6
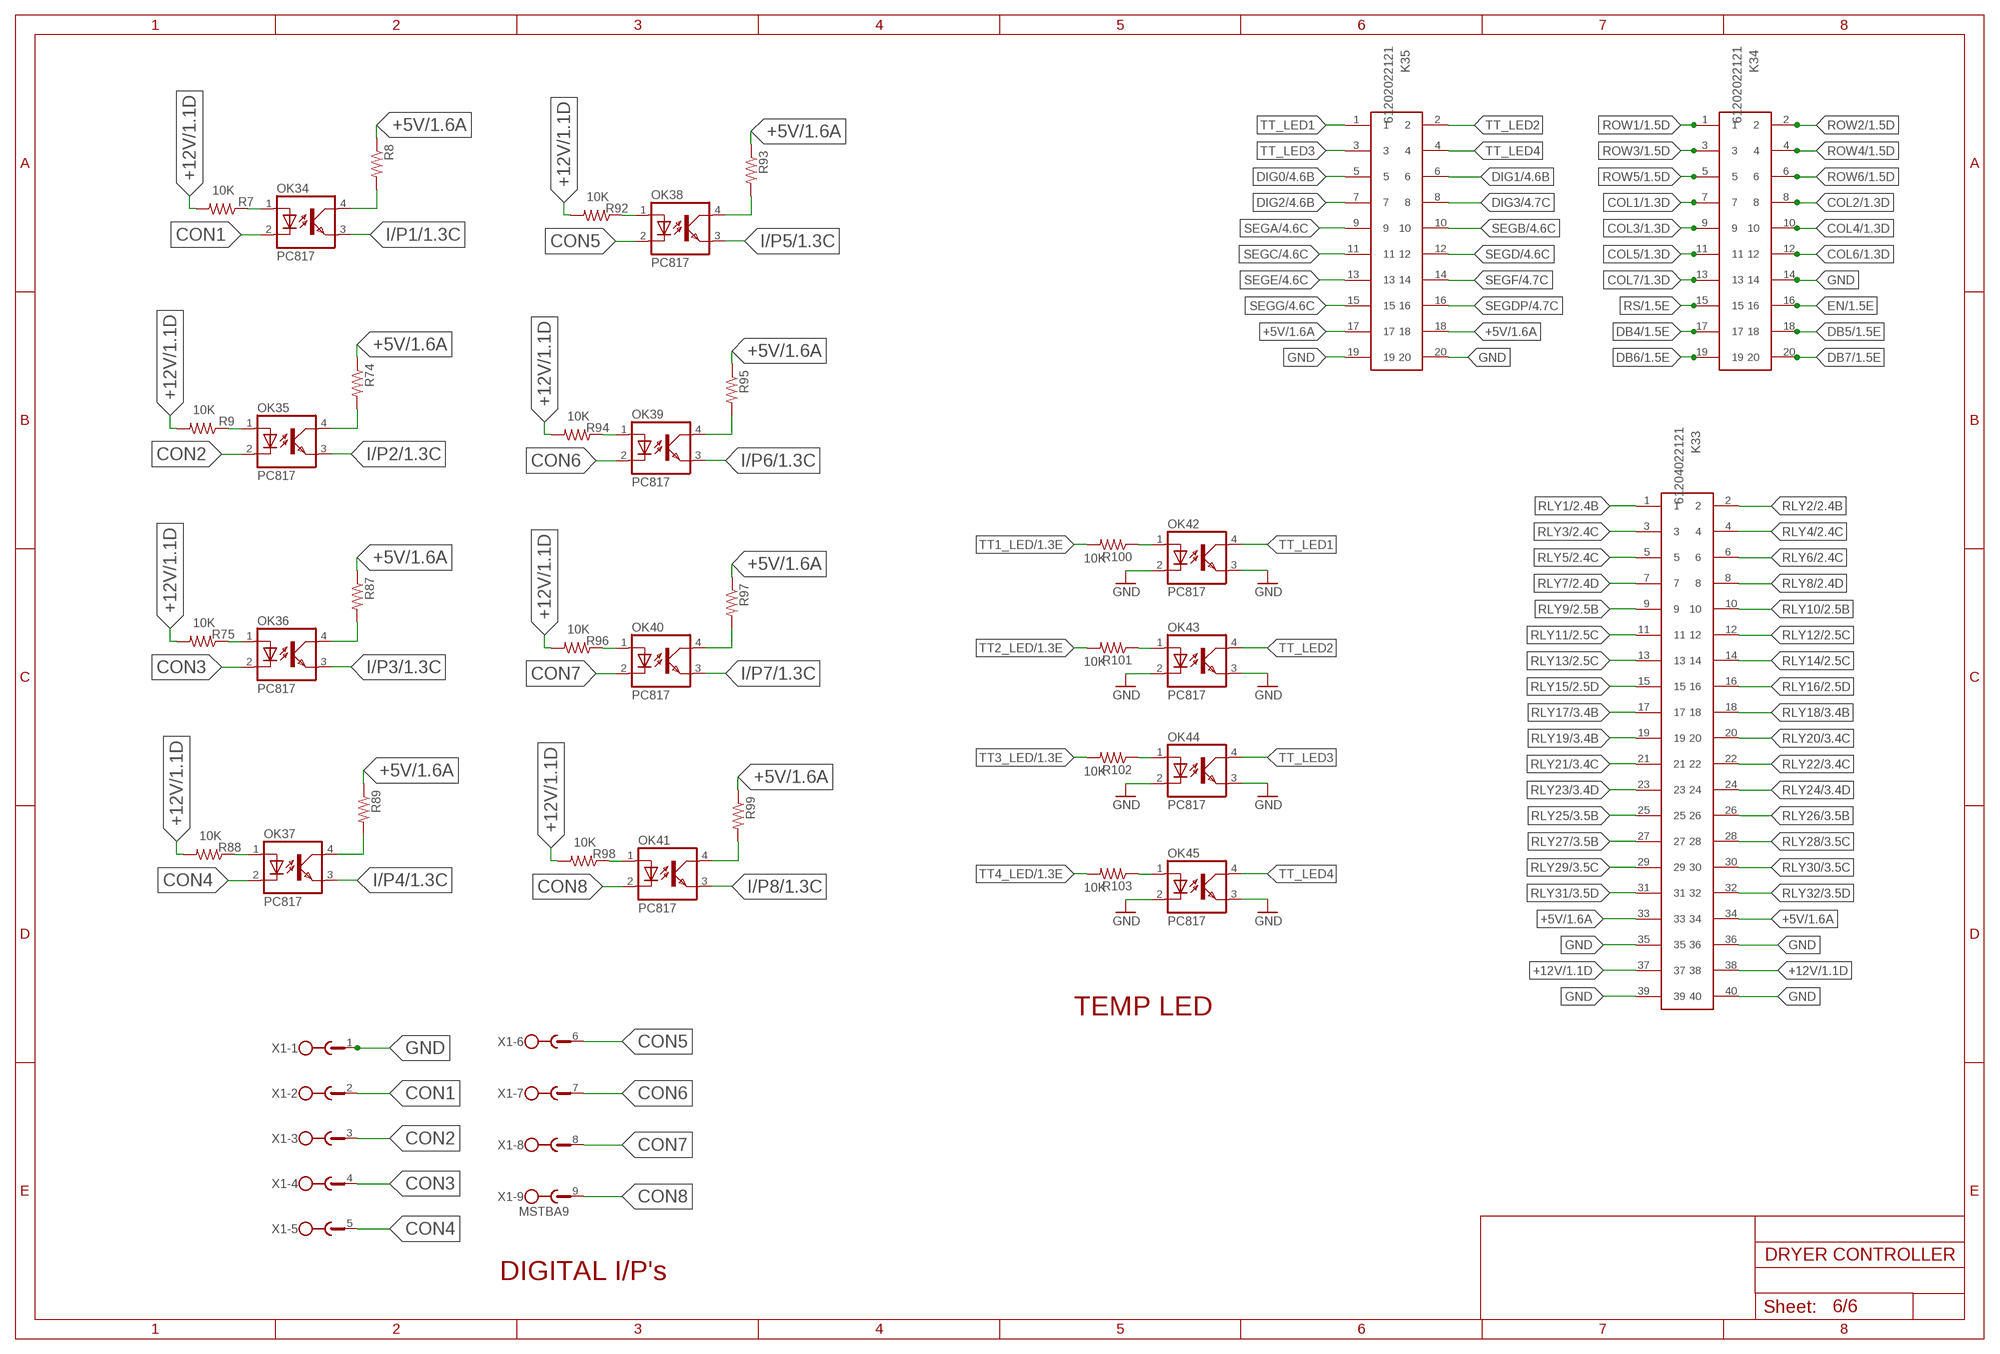
[diagram p5: schematic, sheet 6]

### Parts
K33  61204022121  [61204022121]
K34  61202022121  [61202022121]
K35  61202022121  [61202022121]
OK34  PC817  [DIL04]
OK35  PC817  [DIL04]
OK36  PC817  [DIL04]
OK37  PC817  [DIL04]
OK38  PC817  [DIL04]
OK39  PC817  [DIL04]
OK40  PC817  [DIL04]
OK41  PC817  [DIL04]
OK42  PC817  [DIL04]
OK43  PC817  [DIL04]
OK44  PC817  [DIL04]
OK45  PC817  [DIL04]
R7  10K  R-US_R0805  [R0805]
R8  R-US_R1206  [R1206]
R9  10K  R-US_R0805  [R0805]
R74  R-US_R1206  [R1206]
R75  10K  R-US_R0805  [R0805]
R87  R-US_R1206  [R1206]
R88  10K  R-US_R0805  [R0805]
R89  R-US_R1206  [R1206]
R92  10K  R-US_R0805  [R0805]
R93  R-US_R1206  [R1206]
R94  10K  R-US_R0805  [R0805]
R95  R-US_R1206  [R1206]
R96  10K  R-US_R0805  [R0805]
R97  R-US_R1206  [R1206]
R98  10K  R-US_R0805  [R0805]
R99  R-US_R1206  [R1206]
R100  10K  R-US_R0805  [R0805]
R101  10K  R-US_R0805  [R0805]
R102  10K  R-US_R0805  [R0805]
R103  10K  R-US_R0805  [R0805]
X1  MSTBA9  [MSTBA9]

### Nets
+5V: K33.33 K33.34 K35.17 K35.18 R8.1 R74.1 R87.1 R89.1 R93.1 R95.1 R97.1 R99.1 ; also sheet 1,4,5
+12V: K33.37 K33.38 R7.2 R9.2 R75.2 R88.2 R92.2 R94.2 R96.2 R98.2 ; also sheet 1,2,3,4
COL1: K34.7 ; also sheet 1
COL2: K34.8 ; also sheet 1
COL3: K34.9 ; also sheet 1
COL4: K34.10 ; also sheet 1
COL5: K34.11 ; also sheet 1
COL6: K34.12 ; also sheet 1
COL7: K34.13 ; also sheet 1
CON1 [gnd]: OK34.2(C) X1.2
CON2 [gnd]: OK35.2(C) X1.3
CON3 [gnd]: OK36.2(C) X1.4
CON4 [gnd]: OK37.2(C) X1.5
CON5 [gnd]: OK38.2(C) X1.6
CON6 [gnd]: OK39.2(C) X1.7
CON7 [gnd]: OK40.2(C) X1.8
CON8 [gnd]: OK41.2(C) X1.9
DB4: K34.17 ; also sheet 1
DB5: K34.18 ; also sheet 1
DB6: K34.19 ; also sheet 1
DB7: K34.20 ; also sheet 1
DIG0: K35.5 ; also sheet 4
DIG1: K35.6 ; also sheet 4
DIG2: K35.7 ; also sheet 4
DIG3: K35.8 ; also sheet 4
EN: K34.16 ; also sheet 1
GND [gnd]: K33.35 K33.36 K33.39 K33.40 K34.14 K35.19 K35.20 OK42.2(C) OK42.3(EMIT) OK43.2(C) OK43.3(EMIT) OK44.2(C) OK44.3(EMIT) OK45.2(C) OK45.3(EMIT) X1.1 ; also sheet 1,2,3,4,5
I/P1: OK34.3(EMIT) ; also sheet 1
I/P2: OK35.3(EMIT) ; also sheet 1
I/P3: OK36.3(EMIT) ; also sheet 1
I/P4: OK37.3(EMIT) ; also sheet 1
I/P5: OK38.3(EMIT) ; also sheet 1
I/P6: OK39.3(EMIT) ; also sheet 1
I/P7: OK40.3(EMIT) ; also sheet 1
I/P8: OK41.3(EMIT) ; also sheet 1
N$1: OK34.1(A) R7.1
N$98: OK35.1(A) R9.1
N$100: OK35.4(COL) R74.2
N$101: OK36.1(A) R75.1
N$102: OK36.4(COL) R87.2
N$104: OK37.1(A) R88.1
N$105: OK34.4(COL) R8.2
N$107: OK37.4(COL) R89.2
N$109: OK39.1(A) R94.1
N$112: OK39.4(COL) R95.2
N$113: OK40.1(A) R96.1
N$115: OK40.4(COL) R97.2
N$116: OK41.1(A) R98.1
N$118: OK41.4(COL) R99.2
N$119: OK38.1(A) R92.1
N$120: OK38.4(COL) R93.2
N$122: OK42.1(A) R100.1
N$123: OK43.1(A) R101.1
N$124: OK44.1(A) R102.1
N$125: OK45.1(A) R103.1
RLY1: K33.1 ; also sheet 2
RLY2: K33.2 ; also sheet 2
RLY3: K33.3 ; also sheet 2
RLY4: K33.4 ; also sheet 2
RLY5: K33.5 ; also sheet 2
RLY6: K33.6 ; also sheet 2
RLY7: K33.7 ; also sheet 2
RLY8: K33.8 ; also sheet 2
RLY9: K33.9 ; also sheet 2
RLY10: K33.10 ; also sheet 2
RLY11: K33.11 ; also sheet 2
RLY12: K33.12 ; also sheet 2
RLY13: K33.13 ; also sheet 2
RLY14: K33.14 ; also sheet 2
RLY15: K33.15 ; also sheet 2
RLY16: K33.16 ; also sheet 2
RLY17: K33.17 ; also sheet 3
RLY18: K33.18 ; also sheet 3
RLY19: K33.19 ; also sheet 3
RLY20: K33.20 ; also sheet 3
RLY21: K33.21 ; also sheet 3
RLY22: K33.22 ; also sheet 3
RLY23: K33.23 ; also sheet 3
RLY24: K33.24 ; also sheet 3
RLY25: K33.25 ; also sheet 3
RLY26: K33.26 ; also sheet 3
RLY27: K33.27 ; also sheet 3
RLY28: K33.28 ; also sheet 3
RLY29: K33.29 ; also sheet 3
RLY30: K33.30 ; also sheet 3
RLY31: K33.31 ; also sheet 3
RLY32: K33.32 ; also sheet 3
ROW1: K34.1 ; also sheet 1
ROW2: K34.2 ; also sheet 1
ROW3: K34.3 ; also sheet 1
ROW4: K34.4 ; also sheet 1
ROW5: K34.5 ; also sheet 1
ROW6: K34.6 ; also sheet 1
RS: K34.15 ; also sheet 1
SEGA: K35.9 ; also sheet 4
SEGB: K35.10 ; also sheet 4
SEGC: K35.11 ; also sheet 4
SEGD: K35.12 ; also sheet 4
SEGDP: K35.16 ; also sheet 4
SEGE: K35.13 ; also sheet 4
SEGF: K35.14 ; also sheet 4
SEGG: K35.15 ; also sheet 4
TT1_LED: R100.2 ; also sheet 1
TT2_LED: R101.2 ; also sheet 1
TT3_LED: R102.2 ; also sheet 1
TT4_LED: R103.2 ; also sheet 1
TT_LED1: K35.1 OK42.4(COL)
TT_LED2: K35.2 OK43.4(COL)
TT_LED3: K35.3 OK44.4(COL)
TT_LED4: K35.4 OK45.4(COL)

### Notes on the sheet
- TEMP LED
- DIGITAL I/P's

## Library data of the parts
B1 = rectifier:2KBP: RECTIFIER grid 3 x 3,81 mm
C1-C3 C6-C9 C11 C12 C14-C39 C41-C44 = rcl:C-US: CAPACITOR, American symbol
C4 C5 = SparkFun-Capacitors:CAP: Capacitor Standard 0603 ceramic capacitor, and 0.1" leaded capacitor.
C10 C45 = SparkFun-Capacitors:1000UF-25V(PTH): CAP-08070; PROD_ID: CAP-09538
C13 C40 = rcl:CPOL-US: POLARIZED CAPACITOR, American symbol
D1-D32 = diode:1N4004: DIODE general purpose rectifier, 1 A
D33-D64 = SparkFun-LED:LED: LEDs Standard schematic elements and footprints for 5mm, 3mm, 1206, and 0603 sized LEDs. 5mm - Spark Fun Electronics SKU : COM-00529 (and others)
G1 = battery:CR2032H: LI BATTERY Varta
H1-H8 = holes:MOUNT-HOLE: MOUNTING HOLE with drill center marker
IC1-IC4 = 74xx-eu:74*373: Octal D type transparent LATCH, edge triggered
IC5 = linear:78*: Positive VOLTAGE REGULATOR Source: http://cache.national.com/ds/LM/LM78L05.pdf http://www.fairchildsemi.com/ds/LM/LM7805.pdf
IC6 = analog-devices:AD780: High Precision Reference 2.5V/3.0V Source: http://www.analog.com/UploadedFiles/Data_Sheets/AD780.pdf; MPN: AD780BRZ-REEL; OC_FARNELL: 1464655; OC_NEWARK: 12M8938
J1 = SparkFun-Connectors:AVR_SPI_PROG2: AVR 10-pin ICSP Header This is the standard AVR In Circuit Serial Programming header. Minimal, but includes pin one indicator. Works with standard Olimex programmers. Also look for the 6-pin reduced version. Spark Fun Electronics SKU: PRT-00778
K1-K32 = relay:G5LE: RELAY 1 x switch, 10 A/120 V AC, 8 A/30 V DC, Omron; OC_FARNELL: unknown; OC_NEWARK: unknown
K33 = Wire_to_Board_Connectors_rev15d:61204022121: WR-BHD 2.54mm Male Angled Box Header With Lever, 40 Pins=>Code : Con_WTB_BHD_2.54_Male_THT_WS_61204022121 <http://katalog.we-online.de/media/thumbs2/eican/thb_Con_WTB_BHD_2.54_Male_THT_WS_6120xx22121_pf2.jpg> Details see: http://katalog.we-online.de/en/em/612_0xx_221_21 Created 2014-06-05, Karrer Zheng 2014 (C) Würth Elektronik
K34 K35 = Wire_to_Board_Connectors_rev15d:61202022121: WR-BHD 2.54mm Male Angled Box Header With Lever, 20 Pins=>Code : Con_WTB_BHD_2.54_Male_THT_WS_61202022121 <http://katalog.we-online.de/media/thumbs2/eican/thb_Con_WTB_BHD_2.54_Male_THT_WS_6120xx22121_pf2.jpg> Details see: http://katalog.we-online.de/en/em/612_0xx_221_21 Created 2014-06-05, Karrer Zheng 2014 (C) Würth Elektronik
OK1-OK45 = optocoupler:PC817: SHARP OPTO COUPLER; MPN: PC817X4J000F; OC_FARNELL: 9707727; OC_NEWARK: 97K7059
Q1 Q2 = crystal:CRYSTAL: CRYSTAL; OC_FARNELL: 1667008; OC_NEWARK: unknown
R1-R103 = rcl:R-US_: RESISTOR, American symbol
S31 = SparkFun-Electromechanical:SWITCH-MOMENTARY-2: Various NO switches- pushbuttons, reed, etc; PROD_ID: SWCH-11966
SP1 = buzzer:AL60P: SPEAKER Source: Buerklin; OC_FARNELL: unknown; OC_NEWARK: unknown
TP1 TP2 = testpad:PTR1: TEST PIN
U1 = SparkFun-DigitalIC:ATMEGA2560: Atmel 100-pin 8-bit uC 64/128/256 Kbytes FLASH 4 Kbytes EEPROM 8 Kbytes SRAM 86 General Purpose I/O pins 12-channels16-bit PWM 4 x Serial USARTs 16-channels 10-bit A/D; PROD_ID: IC-10040
U$1 = on-semiconductor:CAT24C128
U$2 = SparkFun-FreqCtrl:DS1307: I2C real-time clock with battery backup.
U$3 = Maxim(More):MAX7219CWG
U$4 U$5 = analog-devices:AD7705: 3 V/5 V, 1 mW, 2-/3-Channel, 16-Bit, Sigma-Delta ADCs AD7705/AD7706
U$6 = maxim:MAX13223: 2Tx/2Rx Rs232 Transreciever
U$8 = SparkFun-DigitalIC:RS485: RS485 transceiver
X1 X3-X6 X9 = con-phoenix-508:MSTBA9: PHOENIX; MF: FARNELL; MPN: 1757310; OC_FARNELL: 3705237; OC_NEWARK: 71C4167
X2 = con-phoenix-508:MKDSN1,5/3-5,08: MKDSN 1,5/ 3-5,08 Printklemme Nennstrom: 13,5 A Nennspannung: 250 V Rastermaß: 5,08 mm Polzahl: 3 Anschlussart: Schraubanschluss Montage: Löten Anschlussrichtung Leiter/Platine: 0 ° Artikelnummer: 1729131 Source: http://eshop.phoenixcontact.com .. 1729131.pdf; MPN: SMKDSN1,5/3-5,08; OC_FARNELL: 1792904; OC_NEWARK: 70R0299
X7 = con-subd:F09?S: SUB-D; OC_FARNELL: unknown; OC_NEWARK: unknown
X8 = con-phoenix-508:MSTBA2: PHOENIX; MF: FARNELL; MPN: 1757242; OC_FARNELL: 3705171; OC_NEWARK: 71C4161
Y1 Y2 = SparkFun-FreqCtrl:CRYSTAL: Various standard crystals. Proven footprints.

## Net classes
0 default: width 0.305 mm, drill 0.4 mm, clearance 0.254 mm
2 gnd: width 0.305 mm, drill 0.559 mm, clearance 0.254 mm
3 usbvcc: width 0.508 mm, drill 0.61 mm, clearance 0.254 mm